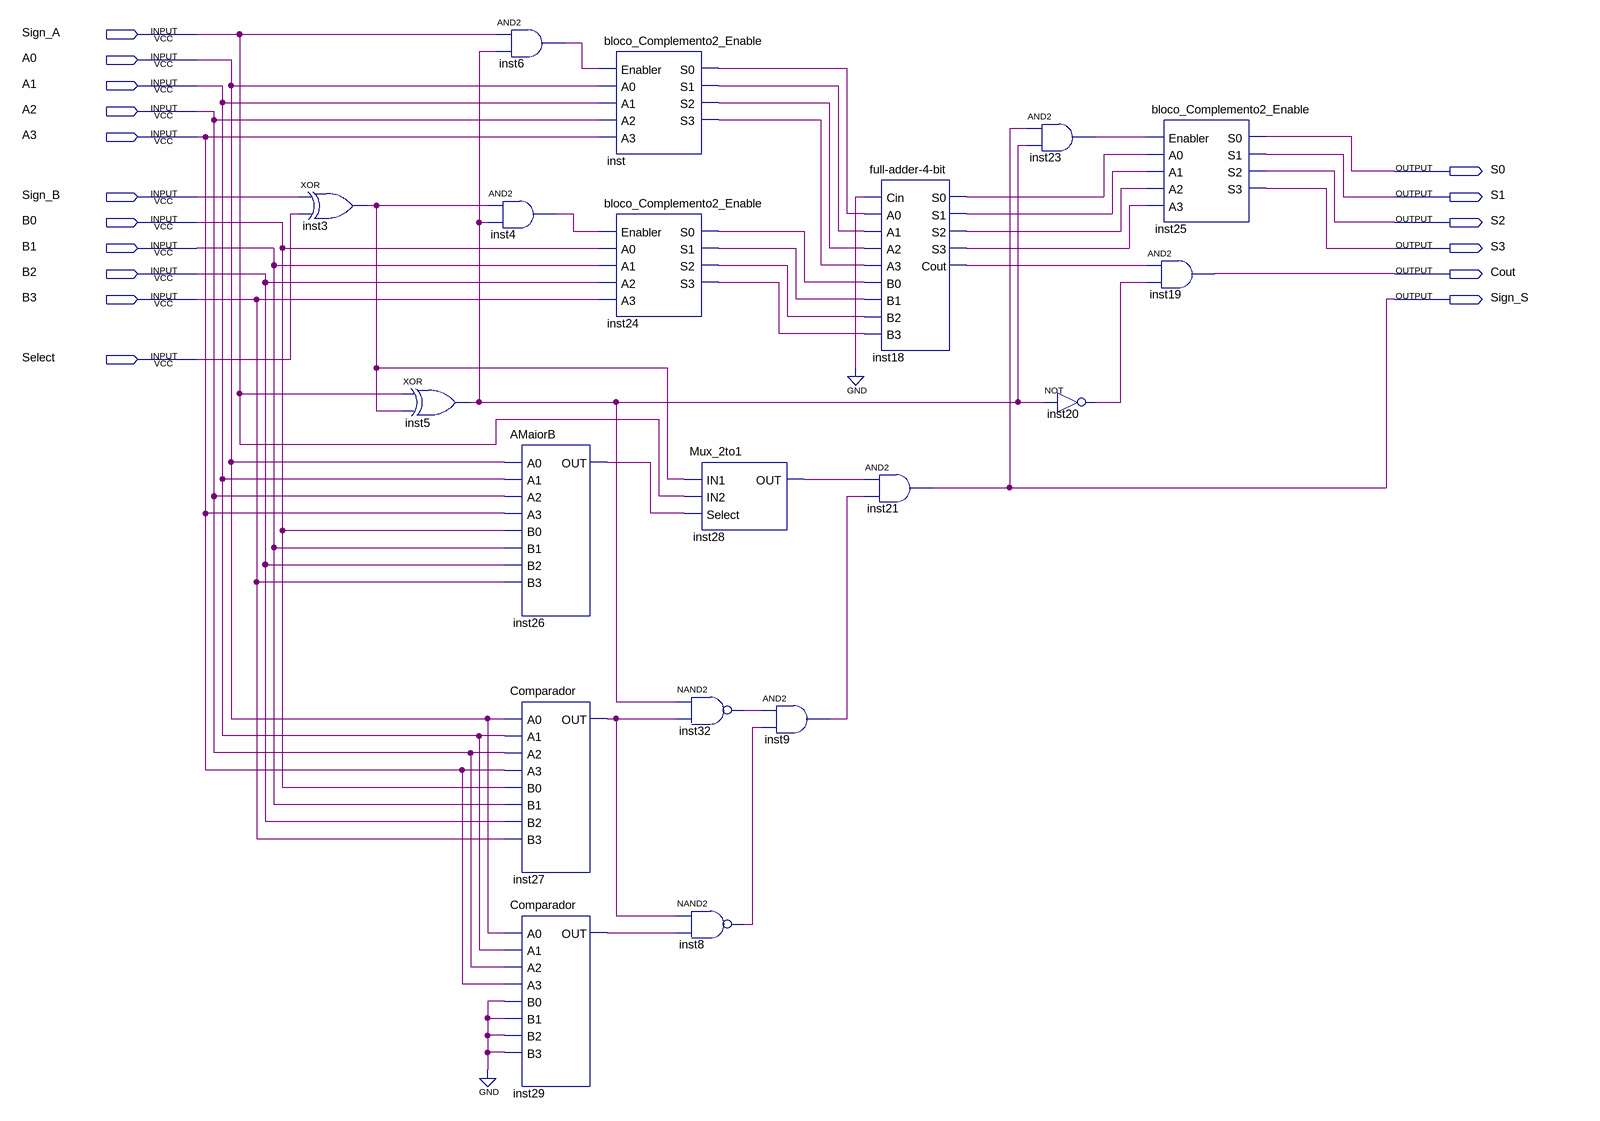
[diagram p0: schematic sheet]
// Quartus schematic OSomador.bdf as structural Verilog: 19 symbols, 17 pins
module OSomador (
  input  Sign_A,
  input  A0,
  input  A1,
  input  A2,
  input  A3,
  input  Sign_B,
  input  B0,
  input  B1,
  input  B2,
  input  B3,
  input  Select,
  output S0,
  output S1,
  output S2,
  output S3,
  output Cout,
  output Sign_S
);

  wire inst3_out, inst4_out, inst5_out, inst6_out, inst8_out, inst9_out, inst18_cout, inst18_s0, inst18_s1,
       inst18_s2, inst18_s3, inst20_out, inst23_out, inst24_s0, inst24_s1, inst24_s2, inst24_s3, inst26_out,
       inst27_out, inst28_out, inst29_out, inst32_out, inst_s0, inst_s1, inst_s2, inst_s3;

  xor inst3 (inst3_out, Sign_B, Select);
  xor inst5 (inst5_out, Sign_A, inst3_out);
  and inst6 (inst6_out, Sign_A, inst5_out);
  and inst4 (inst4_out, inst3_out, inst5_out);
  AMaiorB inst26 (.A0(A0), .A1(A1), .A2(A2), .A3(A3), .B0(B0), .B1(B1), .B2(B2), .B3(B3), .OUT(inst26_out));
  Comparador inst27 (.A0(A0), .A1(A1), .A2(A2), .A3(A3), .B0(B0), .B1(B1), .B2(B2), .B3(B3), .OUT(inst27_out));
  Comparador inst29 (.A0(A0), .A1(A1), .A2(A2), .A3(A3), .B0(1'b0), .B1(1'b0), .B2(1'b0), .B3(1'b0), .OUT(inst29_out));
  bloco_Complemento2_Enable inst (
    .Enabler(inst6_out), .A0(A0), .A1(A1), .A2(A2), .A3(A3), .S0(inst_s0), .S1(inst_s1), .S2(inst_s2),
    .S3(inst_s3));
  bloco_Complemento2_Enable inst24 (
    .Enabler(inst4_out), .A0(B0), .A1(B1), .A2(B2), .A3(B3), .S0(inst24_s0), .S1(inst24_s1), .S2(inst24_s2),
    .S3(inst24_s3));
  nand inst32 (inst32_out, inst5_out, inst27_out);
  nand inst8 (inst8_out, inst27_out, inst29_out);
  Mux_2to1 inst28 (.IN1(inst3_out), .IN2(Sign_A), .Select(inst26_out), .OUT(inst28_out));
  and inst9 (inst9_out, inst32_out, inst8_out);
  \full-adder-4-bit  inst18 (
    .Cin(1'b0), .A0(inst_s0), .A1(inst_s1), .A2(inst_s2), .A3(inst_s3), .B0(inst24_s0), .B1(inst24_s1),
    .B2(inst24_s2), .B3(inst24_s3), .S0(inst18_s0), .S1(inst18_s1), .S2(inst18_s2), .S3(inst18_s3),
    .Cout(inst18_cout));
  and inst21 (Sign_S, inst28_out, inst9_out);
  and inst23 (inst23_out, Sign_S, inst5_out);
  not inst20 (inst20_out, inst5_out);
  bloco_Complemento2_Enable inst25 (
    .Enabler(inst23_out), .A0(inst18_s0), .A1(inst18_s1), .A2(inst18_s2), .A3(inst18_s3), .S0(S0), .S1(S1),
    .S2(S2), .S3(S3));
  and inst19 (Cout, inst18_cout, inst20_out);
endmodule
